# Altium schematic sheet rf_trsw.SchDoc: mcHF Pro Transceiver RF board
size A3; Author: Krassi Atanassov; CompanyName: MØNKA; Engineer: For radio amateurs experimentation, non-commercial use only. Thank you!; Revision: 0.8.5; SheetTotal: 14
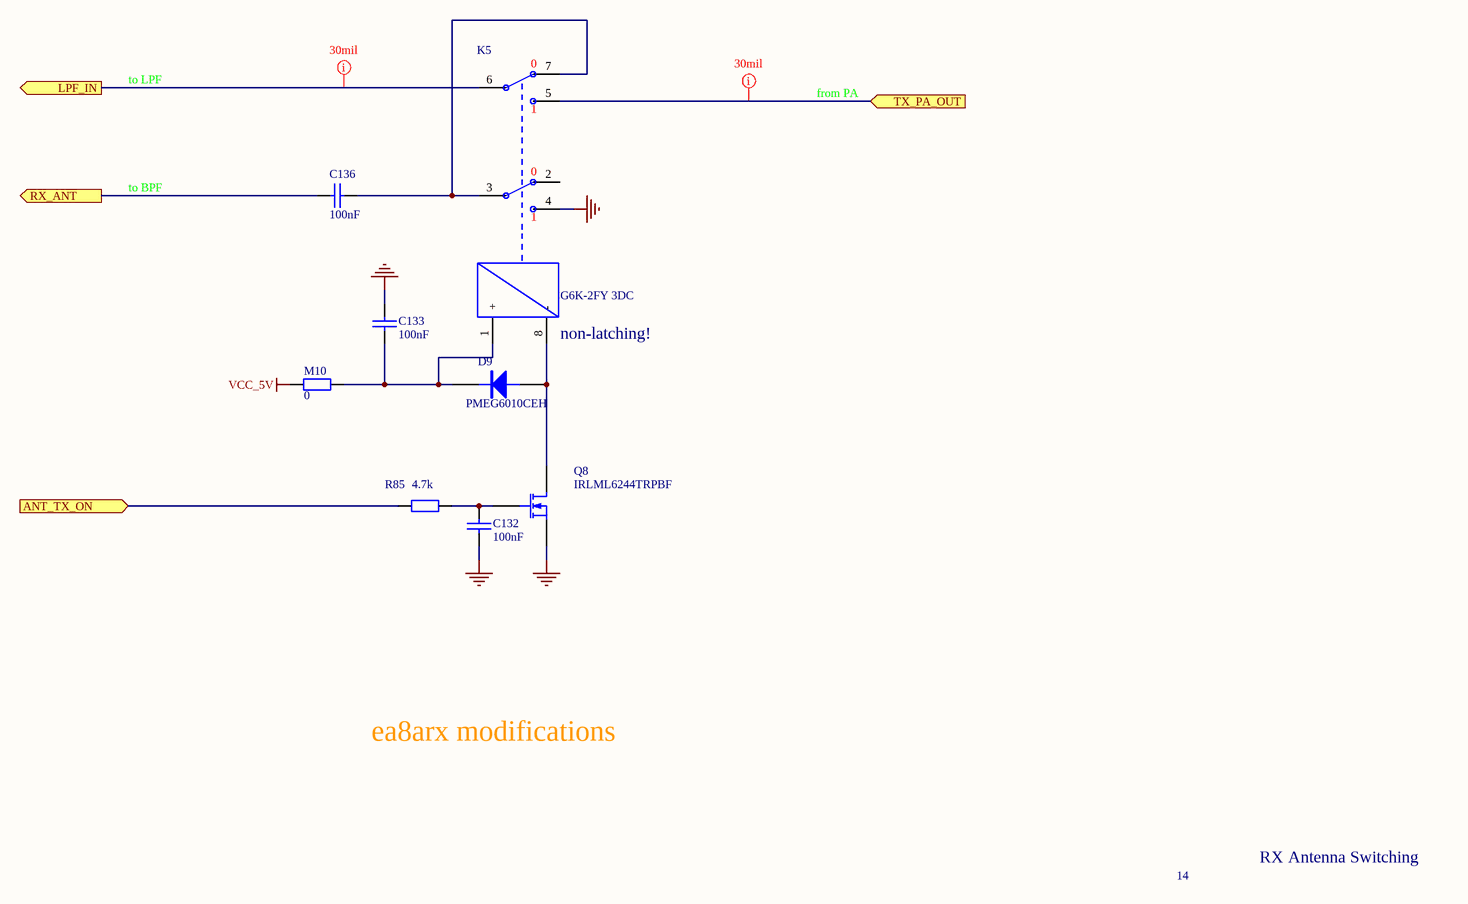
[diagram p0: rf_trsw.SchDoc]

## Parts
C132  100nF  [0805]
C133  100nF  [0805]
C136  100nF  [0805]
D9  PMEG6010CEH  [SOD87]
K5  G6K-2FY 3DC  [Omron_2FY]
M10  0  [0805]
Q8  IRLML6244TRPBF  [SOT-23-Pro]
R85  4.7k  [0805]

## Ports
ANT_TX_ON (in), LPF_IN (out), RX_ANT (out), TX_PA_OUT (in)

## Nets
GND: C132.1 C133.2 K5.4 Q8.2(S)
VCC_5V: M10.2
ANT_TX_ON: R85.1 ; port ANT_TX_ON
LPF_IN: K5.6 ; port LPF_IN
RX_ANT: C136.1 ; port RX_ANT
TX_PA_OUT: K5.5 ; port TX_PA_OUT
NetC132_2: C132.2 Q8.1(G) R85.2
NetC133_1: C133.1 D9.2(K) K5.1(+) M10.1
NetC136_2: C136.2 K5.3 K5.7
NetD9_1: D9.1(A) K5.8(-) Q8.3(D)

Not connected (* = marked no-connect by the designer): K5 2

## Layout directives
rule Width Constraint [Pref Width = 30mil    Min Width = 30mil    Max Width = 30mil]: LPF_IN, TX_PA_OUT

## Notes on the sheet
- to LPF
- from PA
- to BPF
- (near K5) non-latching!
- ea8arx modifications
- 14
- RX Antenna Switching
- Date:
- File:
- Revision:
- Sheet
- of
- Licence:
- (in symbol G6KU-2FY 3DC) 0

## Library data of the parts
C132 C133 = CAP: Capacitor; Voltage: 100V; QT Order: QCC-00154; Price: 0.068
C136 = CAP: Capacitor; Voltage: 100V
D9 = PMEG6010CEH: DIODE, SCHOTTKY, 1A, 60V, SOD-123F; QT Order: QCD-00034; Price: 0.085
K5 = G6KU-2FY 3DC: Single-winding Latching Relay; Notes: cheaper version from Ali; Price: 2.19
M10 = RES: Resistor; QT Order: QCR-00268; Price: 0.009
Q8 = MOSFET-N: N-Channel MOSFET; QT Order: QCT-00022; QT Price: 0.28; Price: 0.231
R85 = RES: Resistor; QT Order: QCR-00339; Price: 0.012